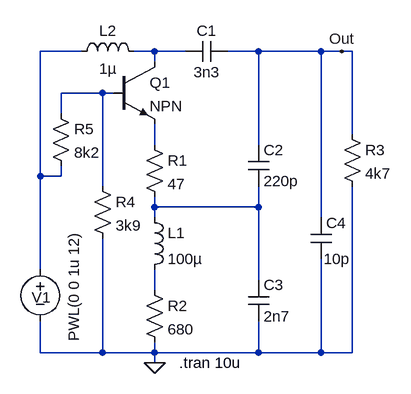
[diagram p0: schematic Colpitts10M7.asc]
Colpitts10M7.asc, the LTspice schematic file:
Version 4
SHEET 1 880 680
WIRE -48 352 -48 160
WIRE -48 496 -48 352
WIRE -48 624 -48 576
WIRE -16 256 -16 224
WIRE -16 352 -48 352
WIRE -16 352 -16 336
WIRE 16 160 -48 160
WIRE 48 224 -16 224
WIRE 48 368 48 224
WIRE 48 624 -48 624
WIRE 48 624 48 448
WIRE 64 224 48 224
WIRE 128 160 96 160
WIRE 128 176 128 160
WIRE 128 304 128 272
WIRE 128 400 128 384
WIRE 128 416 128 400
WIRE 128 528 128 496
WIRE 128 624 48 624
WIRE 128 624 128 608
WIRE 128 640 128 624
WIRE 176 160 128 160
WIRE 288 160 240 160
WIRE 288 304 288 160
WIRE 288 400 128 400
WIRE 288 400 288 368
WIRE 288 512 288 400
WIRE 288 624 128 624
WIRE 288 624 288 576
WIRE 384 160 288 160
WIRE 384 416 384 160
WIRE 384 624 288 624
WIRE 384 624 384 480
WIRE 416 160 384 160
WIRE 432 160 416 160
WIRE 432 288 432 160
WIRE 432 624 384 624
WIRE 432 624 432 368
FLAG 128 640 0
FLAG 416 160 Out
SYMBOL npn3 64 176 R0
SYMATTR InstName Q1
SYMBOL cap 240 144 R90
WINDOW 0 0 32 VBottom 0
WINDOW 3 32 32 VTop 0
SYMATTR InstName C1
SYMATTR Value 3n3
SYMBOL res 112 288 R0
SYMATTR InstName R1
SYMATTR Value 47
SYMBOL ind 112 400 R0
SYMATTR InstName L1
SYMATTR Value 100µ
SYMBOL res 112 512 R0
SYMATTR InstName R2
SYMATTR Value 680
SYMBOL cap 272 304 R0
SYMATTR InstName C2
SYMATTR Value 220p
SYMBOL cap 272 512 R0
SYMATTR InstName C3
SYMATTR Value 2n7
SYMBOL cap 368 416 R0
WINDOW 3 20 64 Left 0
SYMATTR InstName C4
SYMATTR Value 10p
SYMBOL res 416 272 R0
SYMATTR InstName R3
SYMATTR Value 4k7
SYMBOL ind 0 176 R270
WINDOW 0 32 56 VTop 0
WINDOW 3 5 56 VBottom 0
SYMATTR InstName L2
SYMATTR Value 1µ
SYMBOL res 32 352 R0
SYMATTR InstName R4
SYMATTR Value 3k9
SYMBOL res -32 240 R0
SYMATTR InstName R5
SYMATTR Value 8k2
SYMBOL voltage -48 480 R0
WINDOW 0 -13 59 Left 0
WINDOW 3 52 -43 VRight 0
WINDOW 123 0 0 Left 0
WINDOW 39 0 0 Left 0
SYMATTR InstName V1
SYMATTR Value PWL(0 0 1u 12)
TEXT 166 640 Left 0 !.tran 10u

The netlist it stands for:
* Colpitts10M7.asc
Q1 N003 N002 N004 0 NPN
C1 Out N003 3n3
R1 N004 N005 47
L1 N005 N006 100µ
R2 N006 0 680
C2 Out N005 220p
C3 N005 0 2n7
C4 Out 0 10p
R3 Out 0 4k7
L2 N001 N003 1µ
R4 N002 0 3k9
R5 N002 N001 8k2
V1 N001 0 PWL(0 0 1u 12)
.model NPN NPN
.model PNP PNP
.lib standard.bjt
.tran 10u
.backanno
.end